# EAGLE design main (EAGLE 5.11)
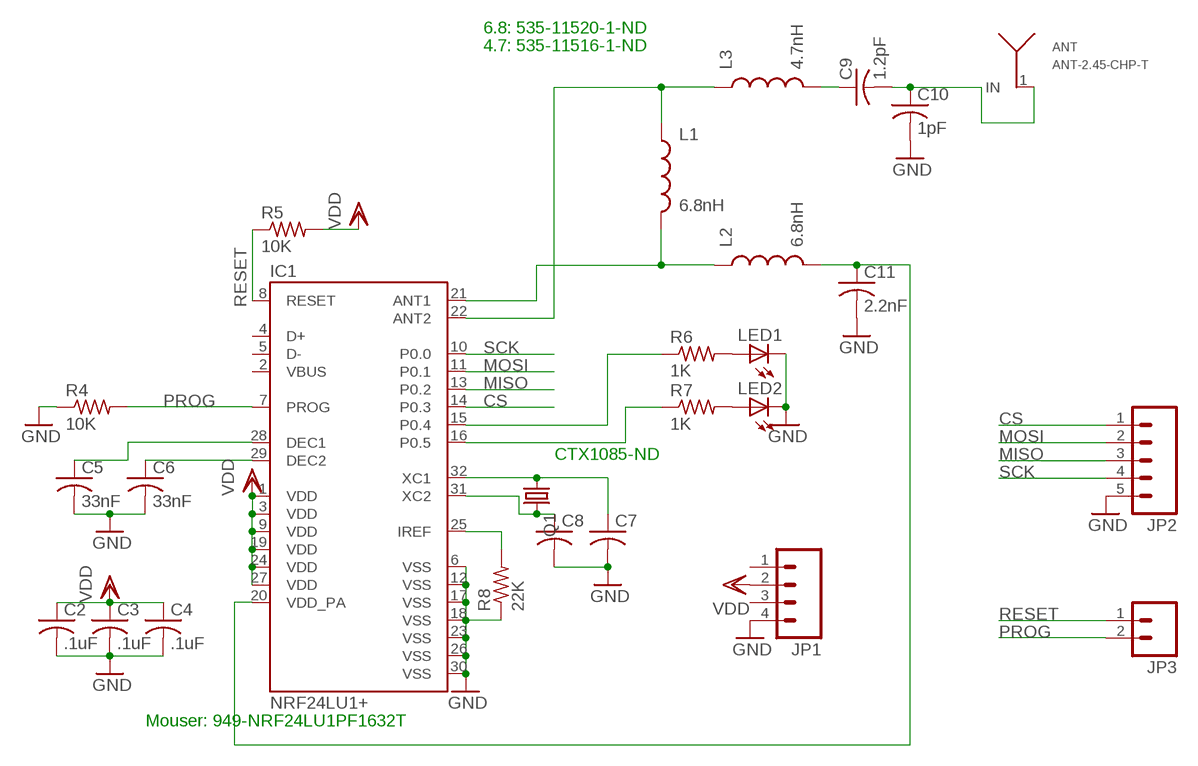
[diagram p0: schematic, sheet 1]

## Parts
ANT  ANT-2.45-CHP-T  [ANT-2.45-CHP-T]
C2  .1uF  C-USC0402  [C0402]
C3  .1uF  C-USC0402  [C0402]
C4  .1uF  C-USC0402  [C0402]
C5  33nF  C-USC0402  [C0402]
C6  33nF  C-USC0402  [C0402]
C7  C-USC0402  [C0402]
C8  C-USC0402  [C0402]
C9  1.2pF  C-USC0402  [C0402]
C10  1pF  C-USC0402  [C0402]
C11  2.2nF  C-USC0402  [C0402]
IC1  NRF24LU1+  [QFN32_5X5]
JP1  M04LOCK  [1X04_LOCK]
JP2  M05LOCK  [1X05_LOCK]
JP3  M02PTH  [1X02]
L1  6.8nH  INDUCTOR0402  [C0402]
L2  6.8nH  INDUCTOR0402  [C0402]
L3  4.7nH  INDUCTOR0402  [C0402]
LED1  LEDCHIP-LED0805  [CHIP-LED0805]
LED2  LEDCHIP-LED0805  [CHIP-LED0805]
Q1  CRYSTALHC49U-V  [HC49U-V]
R4  10K  R-US_R0402  [R0402]
R5  10K  R-US_R0402  [R0402]
R6  1K  R-US_R0402  [R0402]
R7  1K  R-US_R0402  [R0402]
R8  22K  R-US_R0402  [R0402]

## Nets
CS: IC1.14(P0.3) JP2.1
GND: C2.2 C3.2 C4.2 C5.2 C6.2 C7.2 C8.2 C10.2 C11.2 IC1.6(VSS) IC1.12(VSS) IC1.17(VSS) IC1.18(VSS) IC1.23(VSS) IC1.26(VSS) IC1.30(VSS) JP1.4 JP2.5 LED1.C LED2.C R4.1 R8.1
MISO: IC1.13(P0.2) JP2.3
MOSI: IC1.11(P0.1) JP2.2
N$7: C7.1 IC1.32(XC1) Q1.1
N$8: C8.1 IC1.31(XC2) Q1.2
N$9: IC1.22(ANT2) L1.1 L3.1
N$10: C5.1 IC1.28(DEC1)
N$11: C6.1 IC1.29(DEC2)
N$12: LED1.A R6.2
N$13: LED2.A R7.2
N$14: IC1.21(ANT1) L1.2 L2.1
N$15: C9.1 L3.2
N$16: ANT.1(IN) C9.2 C10.1
N$17: IC1.15(P0.4) R6.1
N$18: IC1.16(P0.5) R7.1
N$19: C11.1 IC1.20(VDD_PA) L2.2
N$21: IC1.25(IREF) R8.2
PROG: IC1.7(PROG) JP3.2 R4.2
RESET: IC1.8(RESET) JP3.1 R5.1
SCK: IC1.10(P0.0) JP2.4
VDD: C2.1 C3.1 C4.1 IC1.1(VDD) IC1.3(VDD) IC1.9(VDD) IC1.19(VDD) IC1.24(VDD) IC1.27(VDD) JP1.2 R5.2
Unconnected: IC1.4(D+) IC1.5(D-) JP1.1 JP1.3

## Notes on the sheet
- 6.8: 535-11520-1-ND
- 4.7: 535-11516-1-ND
- CTX1085-ND
- Mouser: 949-NRF24LU1PF1632T

## Power pins joined to a net without a drawn wire
VBUS: IC1.2(VBUS)

## Library data of the parts
ANT = balun:ANT-2.45-CHP-T
C2-C11 = adafruit:C-US: CAPACITOR, American symbol
IC1 = nordic:NRF24LU1+: nRF24LU1+ Single Chip 2.4 GHz Transceiver with USB Microcontroller and Flash Memory Source: nRF24LU1+ - 2.4GHz RF - Products - Nordic Semiconductor <http://www.nordicsemi.com/eng/Products/2.4GHz-RF/nRF24LU1P>
JP1 = SparkFun:M04: Header 4 Standard 4-pin 0.1" header. Use with straight break away headers (SKU : PRT-00116), right angle break away headers (PRT-00553), swiss pins (PRT-00743), machine pins (PRT-00117), and female headers (PRT-00115). Molex polarized connector foot print use with SKU : PRT-08231 with associated crimp pins and housings. 1MM SMD Version SKU: PRT-10208
JP2 = SparkFun:M05: Header 5 Standard 5-pin 0.1" header. Use with straight break away headers (SKU : PRT-00116), right angle break away headers (PRT-00553), swiss pins (PRT-00743), machine pins (PRT-00117), and female headers (PRT-00115). Molex polarized connector foot print use with SKU : PRT-08230 with associated crimp pins and housings.
JP3 = SparkFun:M02: Header 2 Standard 2-pin 0.1" header. Use with straight break away headers (SKU : PRT-00116), right angle break away headers (PRT-00553), swiss pins (PRT-00743), machine pins (PRT-00117), and female headers (PRT-00115). Molex polarized connector foot print use with SKU : PRT-08233 with associated crimp pins and housings.
L1-L3 = SparkFun:INDUCTOR: Inductors Basic Inductor/Choke - 0603 and 1206. Footprints are not proven and vary greatly between part numbers.
LED1 LED2 = adafruit:LED: LED OSRAM: - CHIPLED LG R971, LG N971, LY N971, LG Q971, LY Q971, LO R971, LY R971 LH N974, LH R974 LS Q976, LO Q976, LY Q976 LO Q996 - Hyper CHIPLED LW Q18S LB Q993, LB Q99A, LB R99A - SideLED LS A670, LO A670, LY A670, LG A670, LP A670 LB A673, LV A673, LT A673, LW A673 LH A674 LY A675 LS A676, LA A676, LO A676, LY A676, LW A676 LS A679, LY A679, LG A679 - Hyper Micro SIDELED® LS Y876, LA Y876, LO Y876, LY Y876 LT Y87S - SmartLED LW L88C, LW L88S LB L89C, LB L89S, LG L890 LS L89K, LO L89K, LY L89K LS L896, LA L896, LO L896, LY L896 - TOPLED LS T670, LO T670, LY T670, LG T670, LP T670 LSG T670, LSP T670, LSY T670, LOP T670, LYG T670 LG T671, LOG T671, LSG T671 LB T673, LV T673, LT T673, LW T673 LH T674 LS T676, LA T676, LO T676, LY T676, LB T676, LH T676, LSB T676, LW T676 LB T67C, LV T67C, LT T67C, LS T67K, LO T67K, LY T67K, LW E67C LS E67B, LA E67B, LO E67B, LY E67B, LB E67C, LV E67C, LT E67C LW T67C LS T679, LY T679, LG T679 LS T770, LO T770, LY T770, LG T770, LP T770 LB T773, LV T773, LT T773, LW T773 LH T774 LS E675, LA E675, LY E675, LS T675 LS T776, LA T776, LO T776, LY T776, LB T776 LHGB T686 LT T68C, LB T68C - Hyper Mini TOPLED® LB M676 - Mini TOPLED Santana® LG M470 LS M47K, LO M47K, LY M47K Source: http://www.osram.convergy.de/
Q1 = crystal:CRYSTAL: CRYSTAL; OC_FARNELL: 1666969; OC_NEWARK: unknown
R4-R8 = adafruit:R-US_: RESISTOR, American symbol

## Board
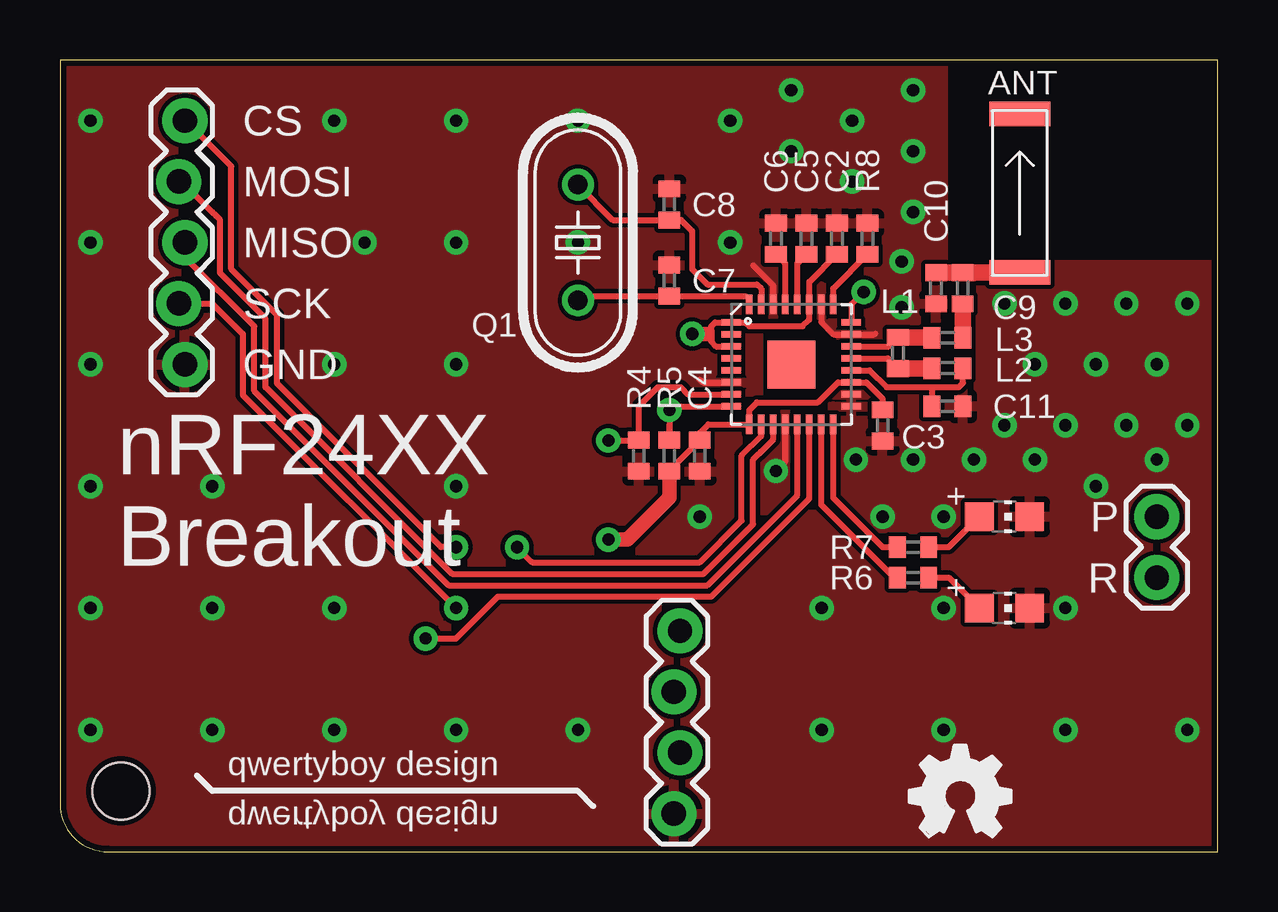
[diagram p1: board, top side]
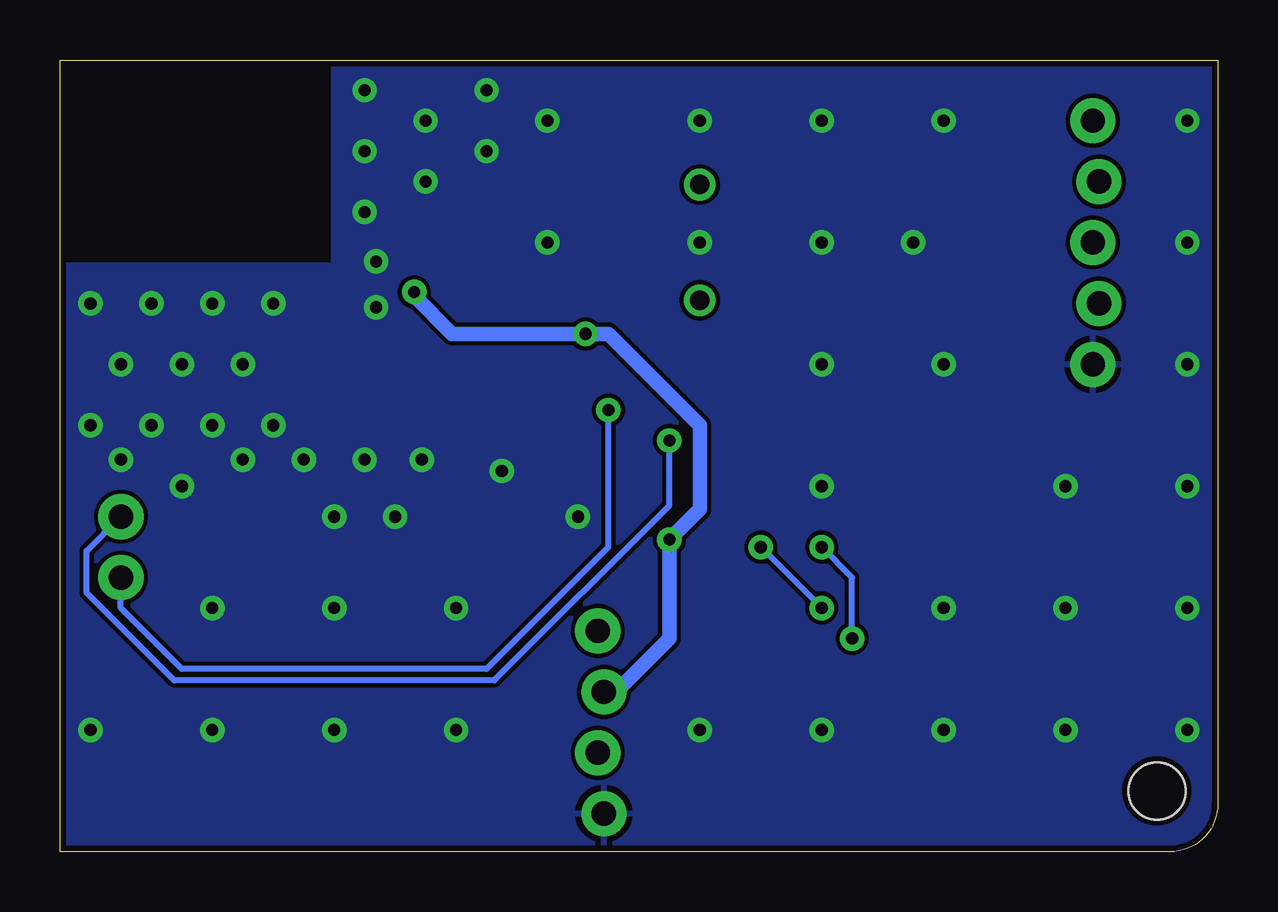
[diagram p2: board, bottom side, seen from below]

Size 48.26 x 33.01 mm. Coordinates in mm from the lower left corner, seen from the top.
Outline: 48.26,0 48.26,33.01 0,33.01 0,2 arc90 2,0 48.26,0
Copper layers (1*16): Top 0.035mm / dielectric 1.5mm / Bottom 0.035mm
Design rules "ITead_rule *": minimum track width 7mil, minimum drill 12mil, track to track 7mil, track to pad 7mil, pad to pad 7mil, via to via 7mil, smd to smd 7mil, copper to edge 10mil, drill to drill 10mil, minimum pad ring 10mil, minimum via ring 8mil, stop-mask expansion 2mil, vias tented up to drill 100mil, thermal gap 10mil
Holes 2.38 mm at 2.54,2.54
tRestrict: 1 lines

### Footprints (pad centres in the part's own frame; a part is rotated, then mirrored left to right if it is on the bottom)
ANT-2.45-CHP-T = smd 1.016 x 2.54: 1 -3.302,0; 2 3.302,0
C0402 = smd 0.7 x 0.9: 1 -0.65,0; 2 0.65,0
QFN32_5X5 = smd 0.285 x 0.8: 1 -1.75,-2.5; 2 -1.25,-2.5; 3 -0.75,-2.5; 4 -0.25,-2.5; 5 0.25,-2.5; 6 0.75,-2.5; 7 1.25,-2.5; 8 1.75,-2.5; 17 1.75,2.5; 18 1.25,2.5; 19 0.75,2.5; 20 0.25,2.5; 21 -0.25,2.5; 22 -0.75,2.5; 23 -1.25,2.5; 24 -1.75,2.5 | smd 0.8 x 0.285: 9 2.5,-1.75; 10 2.5,-1.25; 11 2.5,-0.75; 12 2.5,-0.25; 13 2.5,0.25; 14 2.5,0.75; 15 2.5,1.25; 16 2.5,1.75; 25 -2.5,1.75; 26 -2.5,1.25; 27 -2.5,0.75; 28 -2.5,0.25; 29 -2.5,-0.25; 30 -2.5,-0.75; 31 -2.5,-1.25; 32 -2.5,-1.75 | smd 2 x 2: EP 0,0
1X04_LOCK = drill 1.016 pad 1.88 round: 1 0,0.127; 2 2.54,-0.127; 3 5.08,0.127; 4 7.62,-0.127
1X05_LOCK = drill 1.016 pad 1.88 round: 1 0,0.127; 2 2.54,-0.127; 3 5.08,0.127; 4 7.62,-0.127; 5 10.16,0.127
1X02 = drill 1.016 pad 1.88 round: 1 0,0; 2 2.54,0
CHIP-LED0805 = smd 1.2 x 1.2: A 0,-1.05; C 0,1.05
HC49U-V = drill 0.813 round: 1 -2.413,0; 2 2.413,0
R0402 = smd 0.7 x 0.9: 1 -0.65,0; 2 0.65,0

### Placement (x,y rotation side)
ANT  40.01,27.46 90 top
C2  32.38,25.56 90 top
C3  34.29,17.78 270 top
C4  26.67,16.51 270 top
C5  31.11,25.56 90 top
C6  29.84,25.56 90 top
C7  25.4,23.81 90 top
C8  25.4,26.99 90 top
C9  37.62,23.5 90 top
C10  36.51,23.5 270 top
C11  36.99,18.57 0 top
IC1  30.48,20.32 270 top
JP1  25.72,9.21 270 top
JP2  5.08,30.48 270 top
JP3  45.72,11.43 90 top
L1  34.92,20.8 270 top
L2  36.99,20.16 0 top
L3  36.99,21.43 0 top
LED1  39.37,10.16 270 top
LED2  39.37,13.97 270 top
Q1  21.59,25.4 90 top
R4  24.13,16.51 90 top
R5  25.4,16.51 270 top
R6  35.56,11.43 0 top
R7  35.56,12.7 0 top
R8  33.66,25.56 270 top
U$1  [QWERTYBOY_DESIGN_LOGO]  13.97,2.54 0 bottom
U$2  [OSHW_FILLX150_NOTEXT]  35.4,0.64 0 top

### Tracks (layer width: path | path; a pad name or v marks a point on that pad's centre or on a via)
CS  (via drill 0.51 pad 1.02)
  Top 0.254: IC1.14 31.23,14.72 27.15,10.64 18.26,10.64 16.51,8.89 v15.24,8.89 | v16.51,12.7 15.88,12.7 9.05,19.53 9.05,22.38 7.14,24.29 7.14,28.57 5.24,30.48 JP2.1
  Bottom 0.254: v15.24,8.89 15.24,11.43 v16.51,12.7
GND  (via drill 0.51 pad 1.02)
  Top 0.254: 33.97,21.59 33.95,21.57 IC1.23 32.25,21.57 31.73,22.09 IC1.26 | IC1.30 29.73,23.61 28.89,24.45 | IC1.6 26.79,19.57 26.67,19.68 | IC1.12 30.23,16.26 v29.84,15.88
  other vias: 35.56,31.75 35.56,29.21 35.56,26.67 35.08,24.61 39.37,22.86 41.91,22.86 44.45,22.86 46.99,22.86 45.72,20.32 43.18,20.32 40.64,20.32 33.02,30.48 33.02,27.94 39.37,17.78 41.91,17.78 44.45,17.78 46.99,17.78 38.1,16.35 35.56,16.35 36.83,13.97 34.29,13.97 33.18,16.35 30.48,31.75 30.48,29.21 43.18,15.24 40.64,16.35 45.72,16.35 35.08,22.7 26.67,13.97 1.27,5.08 1.27,10.16 1.27,15.24 6.35,15.24 6.35,10.16 6.35,5.08 11.43,5.08 16.51,5.08 21.59,5.08 11.43,10.16 12.7,25.4 11.43,20.32 16.51,20.32 16.51,15.24 11.43,30.48 16.51,30.48 16.51,25.4 21.59,25.4 21.59,30.48 27.94,30.48 27.94,25.4 31.75,5.08 36.83,5.08 41.91,5.08 46.99,5.08 31.75,10.16 36.83,10.16 41.91,10.16 1.27,30.48 1.27,20.32 1.27,25.4
  pour Top (isolate 0.178): 0,0 48.26,0 48.26,24.45 36.83,24.45 36.83,33.02 0,33.02
  pour Bottom (isolate 0.178): 0,0 48.26,0 48.26,24.45 36.83,24.45 36.83,33.02 0,33.02
MISO
  Top 0.254: IC1.13 30.73,14.86 26.99,11.11 16.19,11.11 8.1,19.21 8.1,21.91 5.21,24.8 JP2.3
MOSI
  Top 0.254: IC1.11 29.73,17.19 29.21,16.67 | 29.21,16.67 | 29.05,16.51 29.21,16.67 | 29.05,16.51 | 29.05,16.51 28.89,16.35 28.89,13.65 26.83,11.59 16.35,11.59 8.57,19.37 8.57,22.23 6.67,24.13 6.67,26.35 6.51,26.51 | JP2.2 5.08,27.94 6.35,26.67 | 6.35,26.67 | 6.51,26.51 6.35,26.67 | 6.51,26.51
N$7
  Top 0.254: Q1.1 21.77,23.16 C7.1 28.59,23.16 28.73,23.02 IC1.32
N$8
  Top 0.254: Q1.2 21.59,27.78 23.03,26.34 C8.1 25.89,26.34 26.35,25.88 26.35,24.29 26.99,23.65 29.05,23.65 29.23,23.48 IC1.31
N$9
  Top 0.254: IC1.22 34.55,21.07 L1.1
  Top 0.686: L1.1 36.32,21.45 L3.1
N$10
  Top 0.254: IC1.28 30.73,24.52 C5.1
N$11
  Top 0.254: IC1.29 30.23,24.52 C6.1
N$12
  Top 0.254: R6.2 37.05,11.43 LED1.A
N$13
  Top 0.254: R7.2 37.05,12.7 LED2.A
N$14
  Top 0.254: IC1.21 34.5,20.57 L1.2
  Top 0.686: L1.2 36.32,20.15 L2.1
N$15
  Top 0.686: L3.2 37.64,22.83 C9.1
N$16
  Top 0.686: C9.2 39.99,24.14 ANT.1 | C10.1 C9.2 | C9.2 38.09,24.14 38.1,24.13 37.64,24.13 C9.2
N$17
  Top 0.254: IC1.15 31.73,14.47 34.77,11.43 R6.1
N$18
  Top 0.254: IC1.16 32.23,14.76 34.29,12.7 R7.1
N$19
  Top 0.254: IC1.20 33.75,20.07 34.45,19.37 36.35,19.37 | 36.35,19.37 37.47,19.37 37.64,19.54 L2.2 | C11.1 36.34,19.35 36.35,19.37
N$21
  Top 0.254: IC1.25 32.23,23.48 R8.2
PROG  (via drill 0.51 pad 1.02)
  Top 0.254: v22.86,17.14 24.11,17.14 R4.2 24.13,18.57 24.92,19.37 25.88,19.37 26.17,19.07 IC1.7
  Bottom 0.254: JP3.2 | JP3.2 47.15,12.54 47.15,10.79 43.5,7.14 30.16,7.14 22.86,14.45 v22.86,17.14
RESET  (via drill 0.51 pad 1.02)
  Top 0.254: 25.4,17.78 R5.1 v25.4,18.41 25.55,18.57 IC1.8
  Bottom 0.254: JP3.1 45.72,10.16 43.18,7.62 30.48,7.62 25.4,12.7 v25.4,18.41
SCK  (via drill 0.51 pad 1.02)
  Top 0.254: IC1.10 29.23,17.32 28.42,16.51 28.42,13.81 26.67,12.06 19.68,12.06 v19.05,12.7 | JP2.4 6.35,22.86 7.62,21.59 7.62,19.05 v16.51,10.16
  Bottom 0.254: v16.51,10.16 v19.05,12.7
VDD  (via drill 0.51 pad 1.02)
  Top 0.254: C2.1 31.23,23.75 IC1.27 31.23,22.18 30.96,21.91 28.73,21.91 28.57,22.07 IC1.1 27.31,22.07 27.15,21.91 27.15,21.75 | C3.1 34.29,18.89 33.61,19.57 IC1.19 32.43,19.57 31.59,18.73 29.05,18.73 28.73,18.41 IC1.9 27.03,17.82 26.67,17.46 C4.1 25.4,15.89 R5.2 | IC1.3 27.35,21.07 27.15,21.27 27.15,21.75 | 26.99,21.59 27.15,21.75 | IC1.24 32.98,22.82 v33.5,23.34
  Top 0.61: v26.35,21.59 26.99,21.59 | v22.86,13.02 23.65,13.02 25.4,14.76 R5.2
  Bottom 0.61: JP1.2 25.08,6.67 22.86,8.89 v22.86,13.02 21.59,14.29 21.59,17.78 25.4,21.59 v26.35,21.59 31.91,21.59 33.5,23.18 v33.5,23.34

### Text on the board
tPlace: CS | MOSI | MISO | SCK | GND | nRF24XX | P | Breakout | R